# Altium project OBC-FPGA.PrjPcb
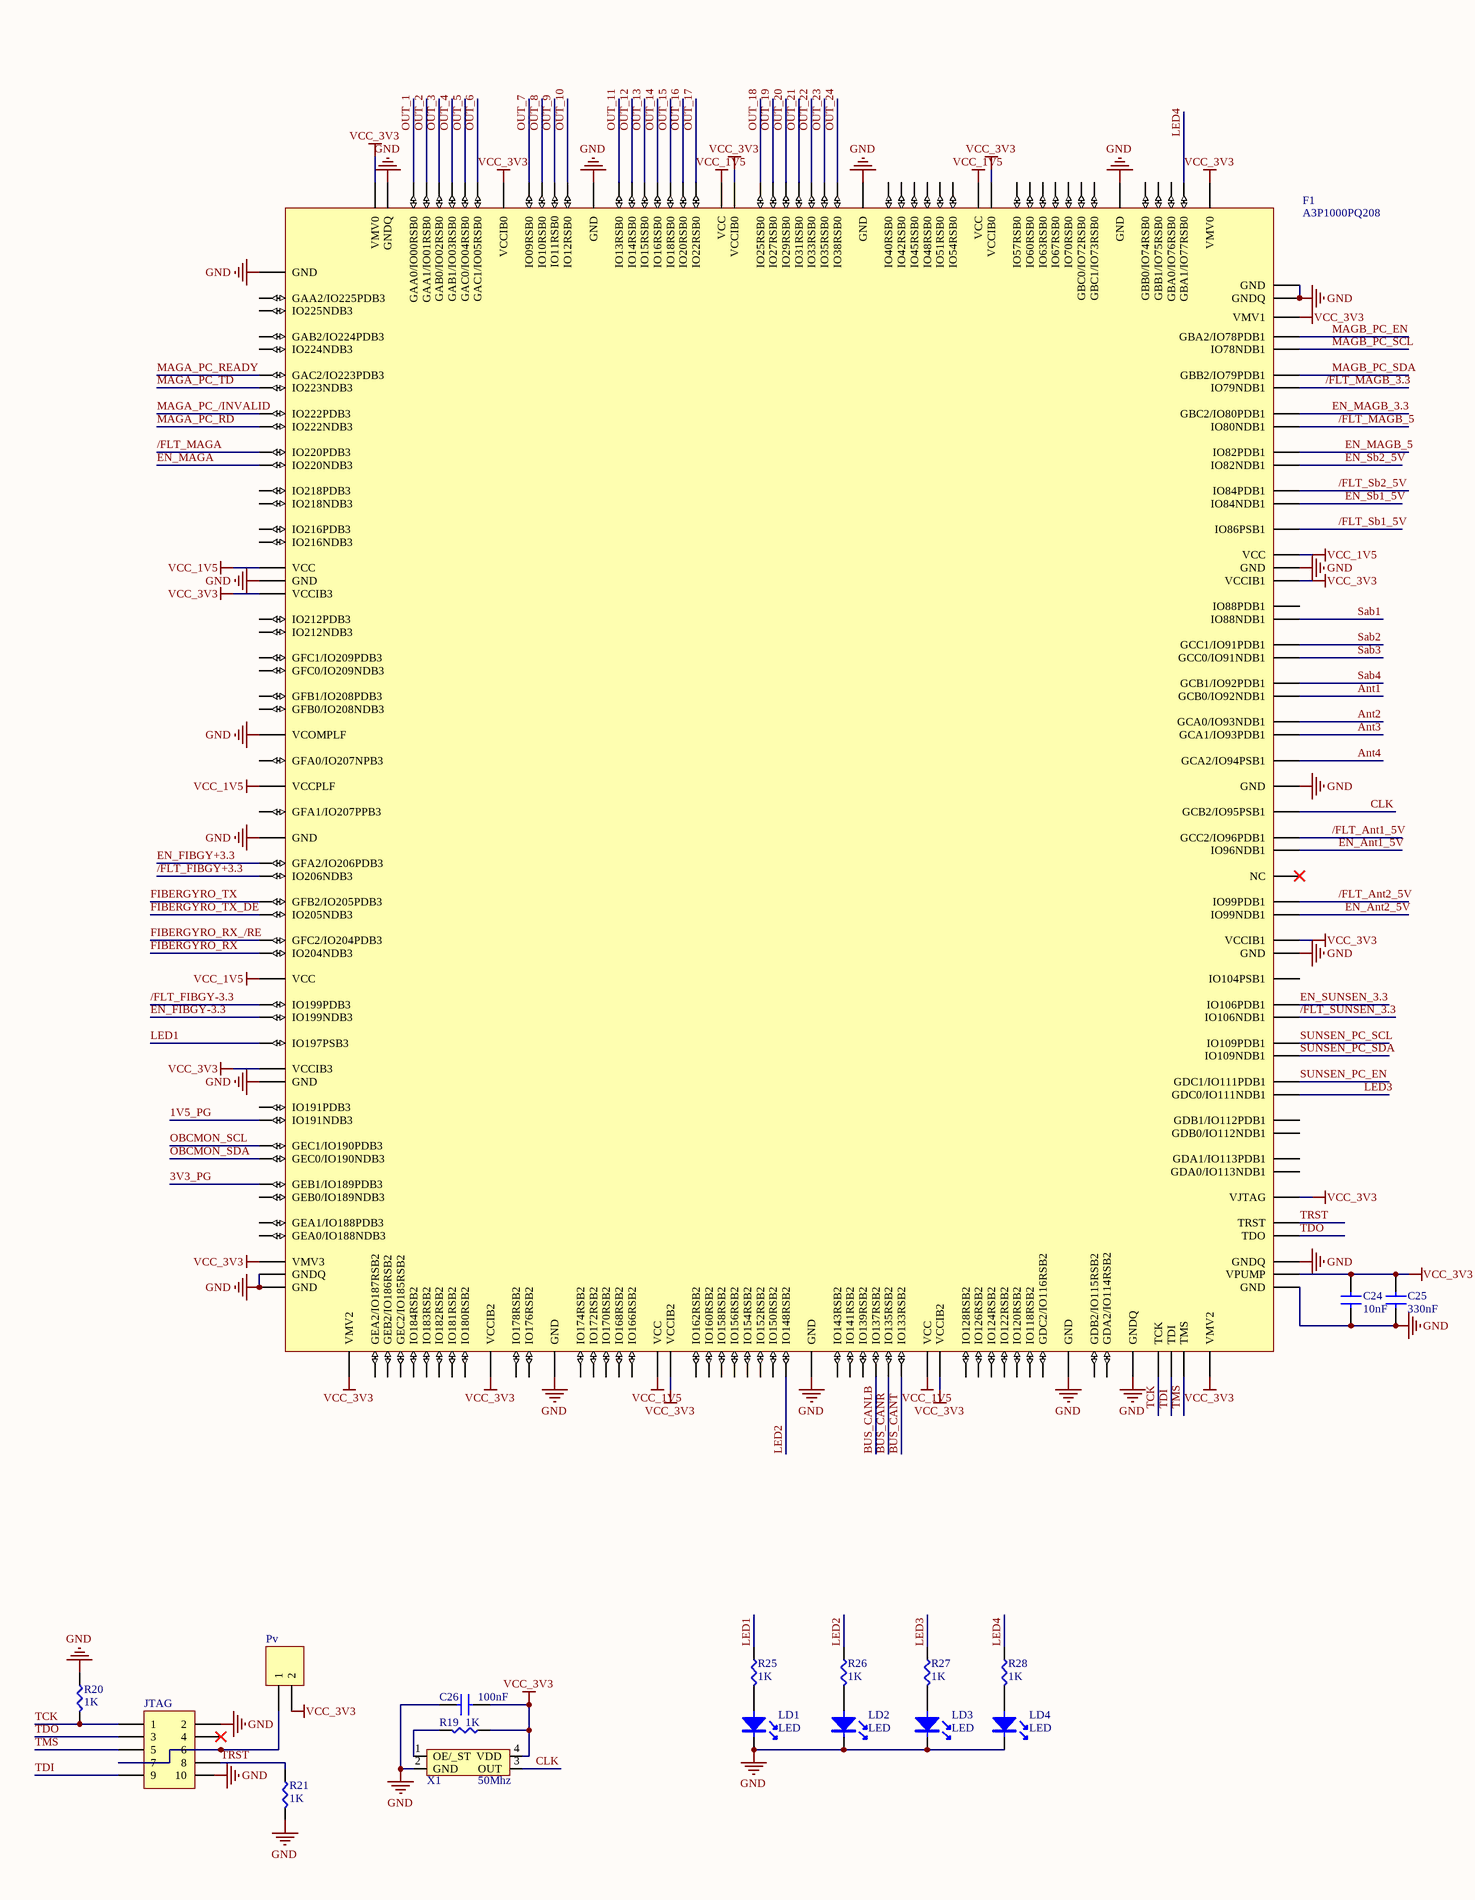
[diagram p0: OBC_My_FPGA.SchDoc, left]
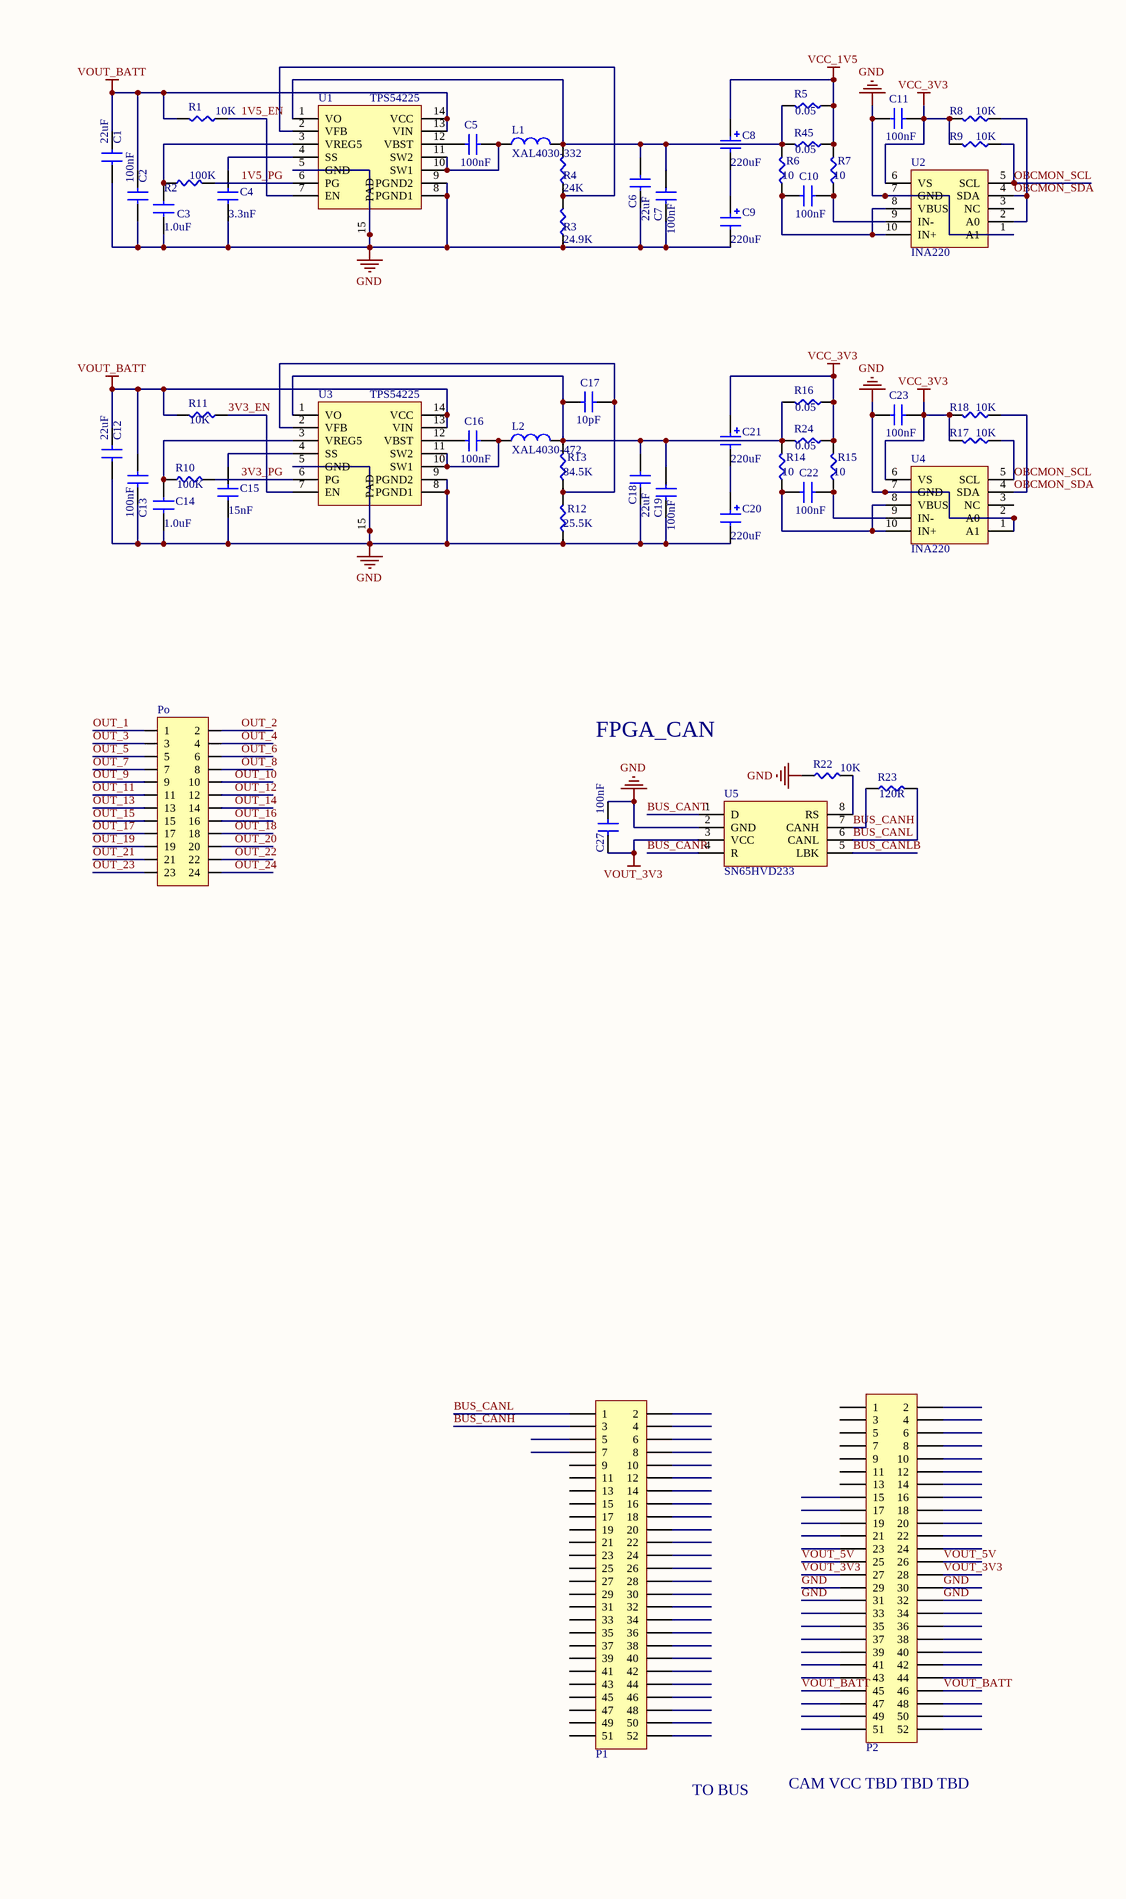
[diagram p1: OBC_My_FPGA.SchDoc, right]
2 sheets, 217 parts. Net scope: global (net labels, ports and power ports of the same name join across sheets).
Board file: OBC-FPGA.PcbDoc
Sheets:
  OBC_My_FPGA.SchDoc
  OBC_My_INTERFACE.SchDoc

## Sheet OBC_My_FPGA.SchDoc
size A2

### Parts
C1  22uF  [1210(3225)-C-IPC]
C2  100nF  [0805(2012)-C-IPC]
C3  1.0uF  [0603(1608)-C-IPC]
C4  3.3nF  [0603(1608)-C-IPC]
C5  100nF  [0603(1608)-C-IPC]
C6  22uF  [1210(3225)-C-IPC]
C7  100nF  [0805(2012)-C-IPC]
C8  220uF  [TanCap-D(7343)-C-IPC]
C9  220uF  [TanCap-D(7343)-C-IPC]
C10  100nF  [0603(1608)-C-IPC]
C11  100nF  [0603(1608)-C-IPC]
C12  22uF  [1210(3225)-C-IPC]
C13  100nF  [0805(2012)-C-IPC]
C14  1.0uF  [0603(1608)-C-IPC]
C15  15nF  [0603(1608)-C-IPC]
C16  100nF  [0603(1608)-C-IPC]
C17  10pF  [0603(1608)-C-IPC]
C18  22uF  [1210(3225)-C-IPC]
C19  100nF  [0805(2012)-C-IPC]
C20  220uF  [TanCap-D(7343)-C-IPC]
C21  220uF  [TanCap-D(7343)-C-IPC]
C22  100nF  [0603(1608)-C-IPC]
C23  100nF  [0603(1608)-C-IPC]
C24  10nF  [0603(1608)-C-IPC]
C25  330nF  [0603(1608)-C-IPC]
C26  100nF  [0603(1608)-C-IPC]
C27  100nF  [0603(1608)-C-IPC]
F1  A3P1000PQ208  [SQFP50P3060X3060X410-208N]
JTAG  Header 5X2  [HDR2X5]  (value not drawn)
L1  XAL4030-332  [Inductor-CoilCraft-XAL40xx]
L2  XAL4030-472  [Inductor-CoilCraft-XAL40xx]
LD1  LED  [0603(1608)-C-IPC]
LD2  LED  [0603(1608)-C-IPC]
LD3  LED  [0603(1608)-C-IPC]
LD4  LED  [0603(1608)-C-IPC]
P1  Header 26X2H  [DIP 26x2-2.54mm]  (value not drawn)
P2  Header 26X2H  [DIP 26x2-2.54mm]  (value not drawn)
Po  Header 12x2  [DIP 12x2-2.54mm]  (value not drawn)
Pv  Header 2  [HDR1X2]  (value not drawn)
R1  10K  [0603(1608)-R-IPC]
R2  100K  [0603(1608)-R-IPC]
R3  24.9K  [0603(1608)-R-IPC]
R4  24K  [0603(1608)-R-IPC]
R5  0.05  [1206(3216)-R-IPC]
R6  10  [0603(1608)-R-IPC]
R7  10  [0603(1608)-R-IPC]
R8  10K  [0603(1608)-R-IPC]
R9  10K  [0603(1608)-R-IPC]
R10  100K  [0603(1608)-R-IPC]
R11  10K  [0603(1608)-R-IPC]
R12  25.5K  [0603(1608)-R-IPC]
R13  84.5K  [0603(1608)-R-IPC]
R14  10  [0603(1608)-R-IPC]
R15  10  [0603(1608)-R-IPC]
R16  0.05  [1206(3216)-R-IPC]
R17  10K  [0603(1608)-R-IPC]
R18  10K  [0603(1608)-R-IPC]
R19  1K  [0603(1608)-R-IPC]
R20  1K  [0603(1608)-R-IPC]
R21  1K  [0603(1608)-R-IPC]
R22  10K  [0603(1608)-R-IPC]
R23  value 120R  [0603(1608)-R-IPC]  (hidden comment: 120)
R24  0.05  [1206(3216)-R-IPC]
R25  1K  [0603(1608)-R-IPC]
R26  1K  [0603(1608)-R-IPC]
R27  1K  [0603(1608)-R-IPC]
R28  1K  [0603(1608)-R-IPC]
R45  0.05  [1206(3216)-R-IPC]
U1  TPS54225  [TSSOP-14-4.4x5-0.65-w.TP-IPC]
U2  INA220  [TSSOP-10-3x3-IPC]
U3  TPS54225  [TSSOP-14-4.4x5-0.65-w.TP-IPC]
U4  INA220  [TSSOP-10-3x3-IPC]
U5  SN65HVD233  [SOP-8-3.9x4.9-IPC]
X1  50Mhz  [LC-SMD-3225_4P]

### Nets
GND: C1.2 C2.2 C3.1 C4.1 C6.2 C7.2 C9.2 C11.2 C12.2 C13.2 C14.1 C15.1 C18.2 C19.2 C20.2 C23.2 C24.2 C25.2 C26.2 C27.2 F1.1(GND) F1.17(GND) F1.25(VCOMPLF) F1.29(GND) F1.41(GND) F1.51(GNDQ) F1.52(GND) F1.65(GND) F1.81(GND) F1.97(GND) F1.100(GNDQ) F1.105(GND) F1.107(GNDQ) F1.122(GND) F1.130(GND) F1.141(GND) F1.155(GNDQ) F1.156(GND) F1.162(GND) F1.178(GND) F1.195(GND) F1.207(GNDQ) JTAG.2 LD1.2(K) LD2.2(K) LD3.2(K) LD4.2(K) P2.29 P2.30 P2.31 P2.32 R3.1 R12.1 R20.1 R21.2 R22.1 U1.5(GND) U1.8(PGND1) U1.9(PGND2) U1.15(PAD) U2.1(A1) U2.7(GND) U3.5(GND) U3.8(PGND1) U3.9(PGND2) U3.15(PAD) U4.1(A1) U4.2(A0) U4.7(GND) U5.2(GND) X1.2(GND)
VCC_1V5: C8.1 F1.16(VCC) F1.27(VCCPLF) F1.36(VCC) F1.71(VCC) F1.88(VCC) F1.142(VCC) F1.171(VCC) F1.187(VCC) R5.1 R7.2 R45.1
VCC_3V3: C11.1 C21.1 C23.1 C24.1 C25.1 C26.1 F1.18(VCCIB3) F1.40(VCCIB3) F1.50(VMV3) F1.53(VMV2) F1.62(VCCIB2) F1.72(VCCIB2) F1.89(VCCIB2) F1.104(VMV2) F1.106(VPUMP) F1.110(VJTAG) F1.123(VCCIB1) F1.140(VCCIB1) F1.154(VMV1) F1.157(VMV0) F1.170(VCCIB0) F1.186(VCCIB0) F1.200(VCCIB0) F1.208(VMV0) Pv.2 R8.2 R9.2 R15.2 R16.1 R17.2 R18.2 R19.1 R24.1 U2.6(VS) U4.6(VS) X1.4(VDD)
VOUT_3V3: C27.1 P2.27 P2.28 U5.3(VCC)
VOUT_5V: P2.25 P2.26
VOUT_BATT: C1.1 C2.1 C12.1 C13.1 P2.45 P2.46 R1.2 R11.2 U1.13(VIN) U1.14(VCC) U3.13(VIN) U3.14(VCC)
1V5_EN: R1.1 U1.7(EN)
1V5_PG: F1.43(IO191NDB3) R2.2 U1.6(PG)
3V3_EN: R11.1 U3.7(EN)
3V3_PG: F1.46(GEB1/IO189PDB3) R10.2 U3.6(PG)
/FLT_Ant1_5V: F1.128(GCC2/IO96PDB1)
/FLT_Ant2_5V: F1.125(IO99PDB1)
/FLT_FIBGY+3.3: F1.31(IO206NDB3)
/FLT_FIBGY-3.3: F1.37(IO199PDB3)
/FLT_MAGA: F1.10(IO220PDB3)
/FLT_MAGB_3.3: F1.150(IO79NDB1)
/FLT_MAGB_5: F1.148(IO80NDB1)
/FLT_Sb1_5V: F1.143(IO86PSB1)
/FLT_Sb2_5V: F1.145(IO84PDB1)
/FLT_SUNSEN_3.3: F1.119(IO106NDB1)
Ant1: F1.134(GCB0/IO92NDB1)
Ant2: F1.133(GCA0/IO93NDB1)
Ant3: F1.132(GCA1/IO93PDB1)
Ant4: F1.131(GCA2/IO94PSB1)
BUS_CANH: P1.3 R23.1 U5.7(CANH)
BUS_CANL: P1.1 R23.2 U5.6(CANL)
BUS_CANLB: F1.85(IO137RSB2) U5.5(LBK)
BUS_CANR: F1.86(IO135RSB2) U5.4(R)
BUS_CANT: F1.87(IO133RSB2) U5.1(D)
CLK: F1.129(GCB2/IO95PSB1) X1.3(OUT)
EN_Ant1_5V: F1.127(IO96NDB1)
EN_Ant2_5V: F1.124(IO99NDB1)
EN_FIBGY+3.3: F1.30(GFA2/IO206PDB3)
EN_FIBGY-3.3: F1.38(IO199NDB3)
EN_MAGA: F1.11(IO220NDB3)
EN_MAGB_3.3: F1.149(GBC2/IO80PDB1)
EN_MAGB_5: F1.147(IO82PDB1)
EN_Sb1_5V: F1.144(IO84NDB1)
EN_Sb2_5V: F1.146(IO82NDB1)
EN_SUNSEN_3.3: F1.120(IO106PDB1)
FIBERGYRO_RX: F1.35(IO204NDB3)
FIBERGYRO_RX_/RE: F1.34(GFC2/IO204PDB3)
FIBERGYRO_TX: F1.32(GFB2/IO205PDB3)
FIBERGYRO_TX_DE: F1.33(IO205NDB3)
LED1: F1.39(IO197PSB3) R25.1
LED2: F1.80(IO148RSB2) R26.1
LED3: F1.115(GDC0/IO111NDB1) R27.1
LED4: F1.158(GBA1/IO77RSB0) R28.1
MAGA_PC_/INVALID: F1.8(IO222PDB3)
MAGA_PC_RD: F1.9(IO222NDB3)
MAGA_PC_READY: F1.6(GAC2/IO223PDB3)
MAGA_PC_TD: F1.7(IO223NDB3)
MAGB_PC_EN: F1.153(GBA2/IO78PDB1)
MAGB_PC_SCL: F1.152(IO78NDB1)
MAGB_PC_SDA: F1.151(GBB2/IO79PDB1)
OBCMON_SCL: F1.44(GEC1/IO190PDB3) R9.1 R17.1 U2.5(SCL) U4.5(SCL)
OBCMON_SDA: F1.45(GEC0/IO190NDB3) R8.1 R18.1 U2.2(A0) U2.4(SDA) U4.4(SDA)
OUT_1: F1.206(GAA0/IO00RSB0) Po.1
OUT_2: F1.205(GAA1/IO01RSB0) Po.2
OUT_3: F1.204(GAB0/IO02RSB0) Po.3
OUT_4: F1.203(GAB1/IO03RSB0) Po.4
OUT_5: F1.202(GAC0/IO04RSB0) Po.5
OUT_6: F1.201(GAC1/IO05RSB0) Po.6
OUT_7: F1.199(IO09RSB0) Po.7
OUT_8: F1.198(IO10RSB0) Po.8
OUT_9: F1.197(IO11RSB0) Po.9
OUT_10: F1.196(IO12RSB0) Po.10
OUT_11: F1.194(IO13RSB0) Po.11
OUT_12: F1.193(IO14RSB0) Po.12
OUT_13: F1.192(IO15RSB0) Po.13
OUT_14: F1.191(IO16RSB0) Po.14
OUT_15: F1.190(IO18RSB0) Po.15
OUT_16: F1.189(IO20RSB0) Po.16
OUT_17: F1.188(IO22RSB0) Po.17
OUT_18: F1.185(IO25RSB0) Po.18
OUT_19: F1.184(IO27RSB0) Po.19
OUT_20: F1.183(IO29RSB0) Po.20
OUT_21: F1.182(IO31RSB0) Po.21
OUT_22: F1.181(IO33RSB0) Po.22
OUT_23: F1.180(IO35RSB0) Po.23
OUT_24: F1.179(IO38RSB0) Po.24
Sab1: F1.138(IO88NDB1)
Sab2: F1.137(GCC1/IO91PDB1)
Sab3: F1.136(GCC0/IO91NDB1)
Sab4: F1.135(GCB1/IO92PDB1)
SUNSEN_PC_EN: F1.116(GDC1/IO111PDB1)
SUNSEN_PC_SCL: F1.118(IO109PDB1)
SUNSEN_PC_SDA: F1.117(IO109NDB1)
TCK: F1.101(TCK) JTAG.1 R20.2
TDI: F1.102(TDI) JTAG.9
TDO: F1.108(TDO) JTAG.3
TMS: F1.103(TMS) JTAG.5
TRST: F1.109(TRST) JTAG.8 R21.1
NetC3_2: C3.2 R2.1 U1.3(VREG5)
NetC4_2: C4.2 U1.4(SS)
NetC5_1: C5.1 L1.1 U1.10(SW1) U1.11(SW2)
NetC5_2: C5.2 U1.12(VBST)
NetC6_1: C6.1 C7.1 L1.2 R4.2 R5.2 R6.2 R45.2 U1.1(VO)
NetC8_2: C8.2 C9.1
NetC10_1: C10.1 R7.1 U2.9(IN-)
NetC10_2: C10.2 R6.1 U2.8(VBUS) U2.10(IN+)
NetC14_2: C14.2 R10.1 U3.3(VREG5)
NetC15_2: C15.2 U3.4(SS)
NetC16_1: C16.1 L2.1 U3.10(SW1) U3.11(SW2)
NetC16_2: C16.2 U3.12(VBST)
NetC17_1: C17.1 R12.2 R13.1 U3.2(VFB)
NetC17_2: C17.2 C18.1 C19.1 L2.2 R13.2 R14.2 R16.2 R24.2 U3.1(VO)
NetC20_1: C20.1 C21.2
NetC22_1: C22.1 R15.1 U4.9(IN-)
NetC22_2: C22.2 R14.1 U4.8(VBUS) U4.10(IN+)
NetJTAG_6: JTAG.6 JTAG.7 Pv.1
NetLD1_1: LD1.1(A) R25.2
NetLD2_1: LD2.1(A) R26.2
NetLD3_1: LD3.1(A) R27.2
NetLD4_1: LD4.1(A) R28.2
NetR3_2: R3.2 R4.1 U1.2(VFB)
NetR19_2: R19.2 X1.1(OE/_ST)
NetR22_2: R22.2 U5.8(RS)

Not connected (* = marked no-connect by the designer): F1 2(GAA2/IO225PDB3) 3(IO225NDB3) 4(GAB2/IO224PDB3) 5(IO224NDB3) 12(IO218PDB3) 13(IO218NDB3) 14(IO216PDB3) 15(IO216NDB3) 19(IO212PDB3) 20(IO212NDB3) 21(GFC1/IO209PDB3) 22(GFC0/IO209NDB3) 23(GFB1/IO208PDB3) 24(GFB0/IO208NDB3) 26(GFA0/IO207NPB3) 28(GFA1/IO207PPB3) 42(IO191PDB3) 47(GEB0/IO189NDB3) 48(GEA1/IO188PDB3) 49(GEA0/IO188NDB3) 54(GEA2/IO187RSB2) 55(GEB2/IO186RSB2) 56(GEC2/IO185RSB2) 57(IO184RSB2) 58(IO183RSB2) 59(IO182RSB2) 60(IO181RSB2) 61(IO180RSB2) 63(IO178RSB2) 64(IO176RSB2) 66(IO174RSB2) 67(IO172RSB2) 68(IO170RSB2) 69(IO168RSB2) 70(IO166RSB2) 73(IO162RSB2) 74(IO160RSB2) 75(IO158RSB2) 76(IO156RSB2) 77(IO154RSB2) 78(IO152RSB2) 79(IO150RSB2) 82(IO143RSB2) 83(IO141RSB2) 84(IO139RSB2) 90(IO128RSB2) 91(IO126RSB2) 92(IO124RSB2) 93(IO122RSB2) 94(IO120RSB2) 95(IO118RSB2) 96(GDC2/IO116RSB2) 98(GDB2/IO115RSB2) 99(GDA2/IO114RSB2) 111(GDA0/IO113NDB1) 112(GDA1/IO113PDB1) 113(GDB0/IO112NDB1) 114(GDB1/IO112PDB1) 121(IO104PSB1) 126(NC)* 139(IO88PDB1) 159(GBA0/IO76RSB0) 160(GBB1/IO75RSB0) 161(GBB0/IO74RSB0) 163(GBC1/IO73RSB0) 164(GBC0/IO72RSB0) 165(IO70RSB0) 166(IO67RSB0) 167(IO63RSB0) 168(IO60RSB0) 169(IO57RSB0) 172(IO54RSB0) 173(IO51RSB0) 174(IO48RSB0) 175(IO45RSB0) 176(IO42RSB0) 177(IO40RSB0); JTAG 4* 10; P1 2 4 5 6 7 8 9 10 11 12 13 14 15 16 17 18 19 20 21 22 23 24 25 26 27 28 29 30 31 32 33 34 35 36 37 38 39 40 41 42 43 44 45 46 47 48 49 50 51 52; P2 1 2 3 4 5 6 7 8 9 10 11 12 13 14 15 16 17 18 19 20 21 22 23 24 33 34 35 36 37 38 39 40 41 42 43 44 47 48 49 50 51 52; U2 3(NC); U4 3(NC)

### Notes on the sheet
- FPGA_CAN
- TO BUS
- (near P2) CAM VCC TBD TBD TBD
- Labels drawn without touching a wire or pin: GND

### Library data of the parts
C1-C7 C10-C19 C22-C27 = Cap_1: Nonpolarized Capacitor (Surface Mount)
  C1 C6 C12 C18: Value: 22uF
  C2 C5 C7 C10 C11 C13 C16 C19 C22 C23 C26 C27: Value: 100nF
  C3 C14: Value: 1.0uF
  C4: Value: 3.3nF
  C15: Value: 15nF
  C17: Value: 10pF
  C24: Value: 10nF
  C25: Value: 330nF
C8 C9 C20 C21 = Cap Pol_1: Polarized Capacitor (Surface Mount); Value: 220uF
F1 = A3P100PQ208: ProASIC3 Flash Family FPGAs
JTAG = Header 5X2: Header, 5-Pin, Dual row; LatestRevisionDate: 17-Jul-2002; LatestRevisionNote: Re-released for DXP Platform.; Publisher: Altium Limited
L1 L2 = Inductor_1: Inductor
P1 P2 = Header 26X2H: Header, 26-Pin, Dual row, Right Angle
Pv = Header 2: Header, 2-Pin; LatestRevisionDate: 17-Jul-2002; LatestRevisionNote: Re-released for DXP Platform.; Publisher: Altium Limited
R1-R28 R45 = Res_1: Resistor
  R1 R8 R9 R11 R17 R18 R22: Value: 10K
  R2 R10: Value: 100K
  R3: Value: 24.9K
  R4: Value: 24K
  R5 R16 R24 R45: Value: 0.05
  R6 R7 R14 R15: Value: 10
  R12: Value: 25.5K
  R13: Value: 84.5K
  R19-R21 R25-R28: Value: 1K
U1 U3 = TPS54225: 4.5V to 18V Input, 2-A Synchronous Step-Down SWIFT Converter
U2 U4 = INA220: High- or Low-Side, Bidirectional Current and Power Monitor With Two-Wire Interface
U5 = SN65HVD233: 3.3-V CAN Bus Transceivers
X1 = SiT1602: Standard Frequency Oscillator SiT1602

## Sheet OBC_My_INTERFACE.SchDoc
size A2
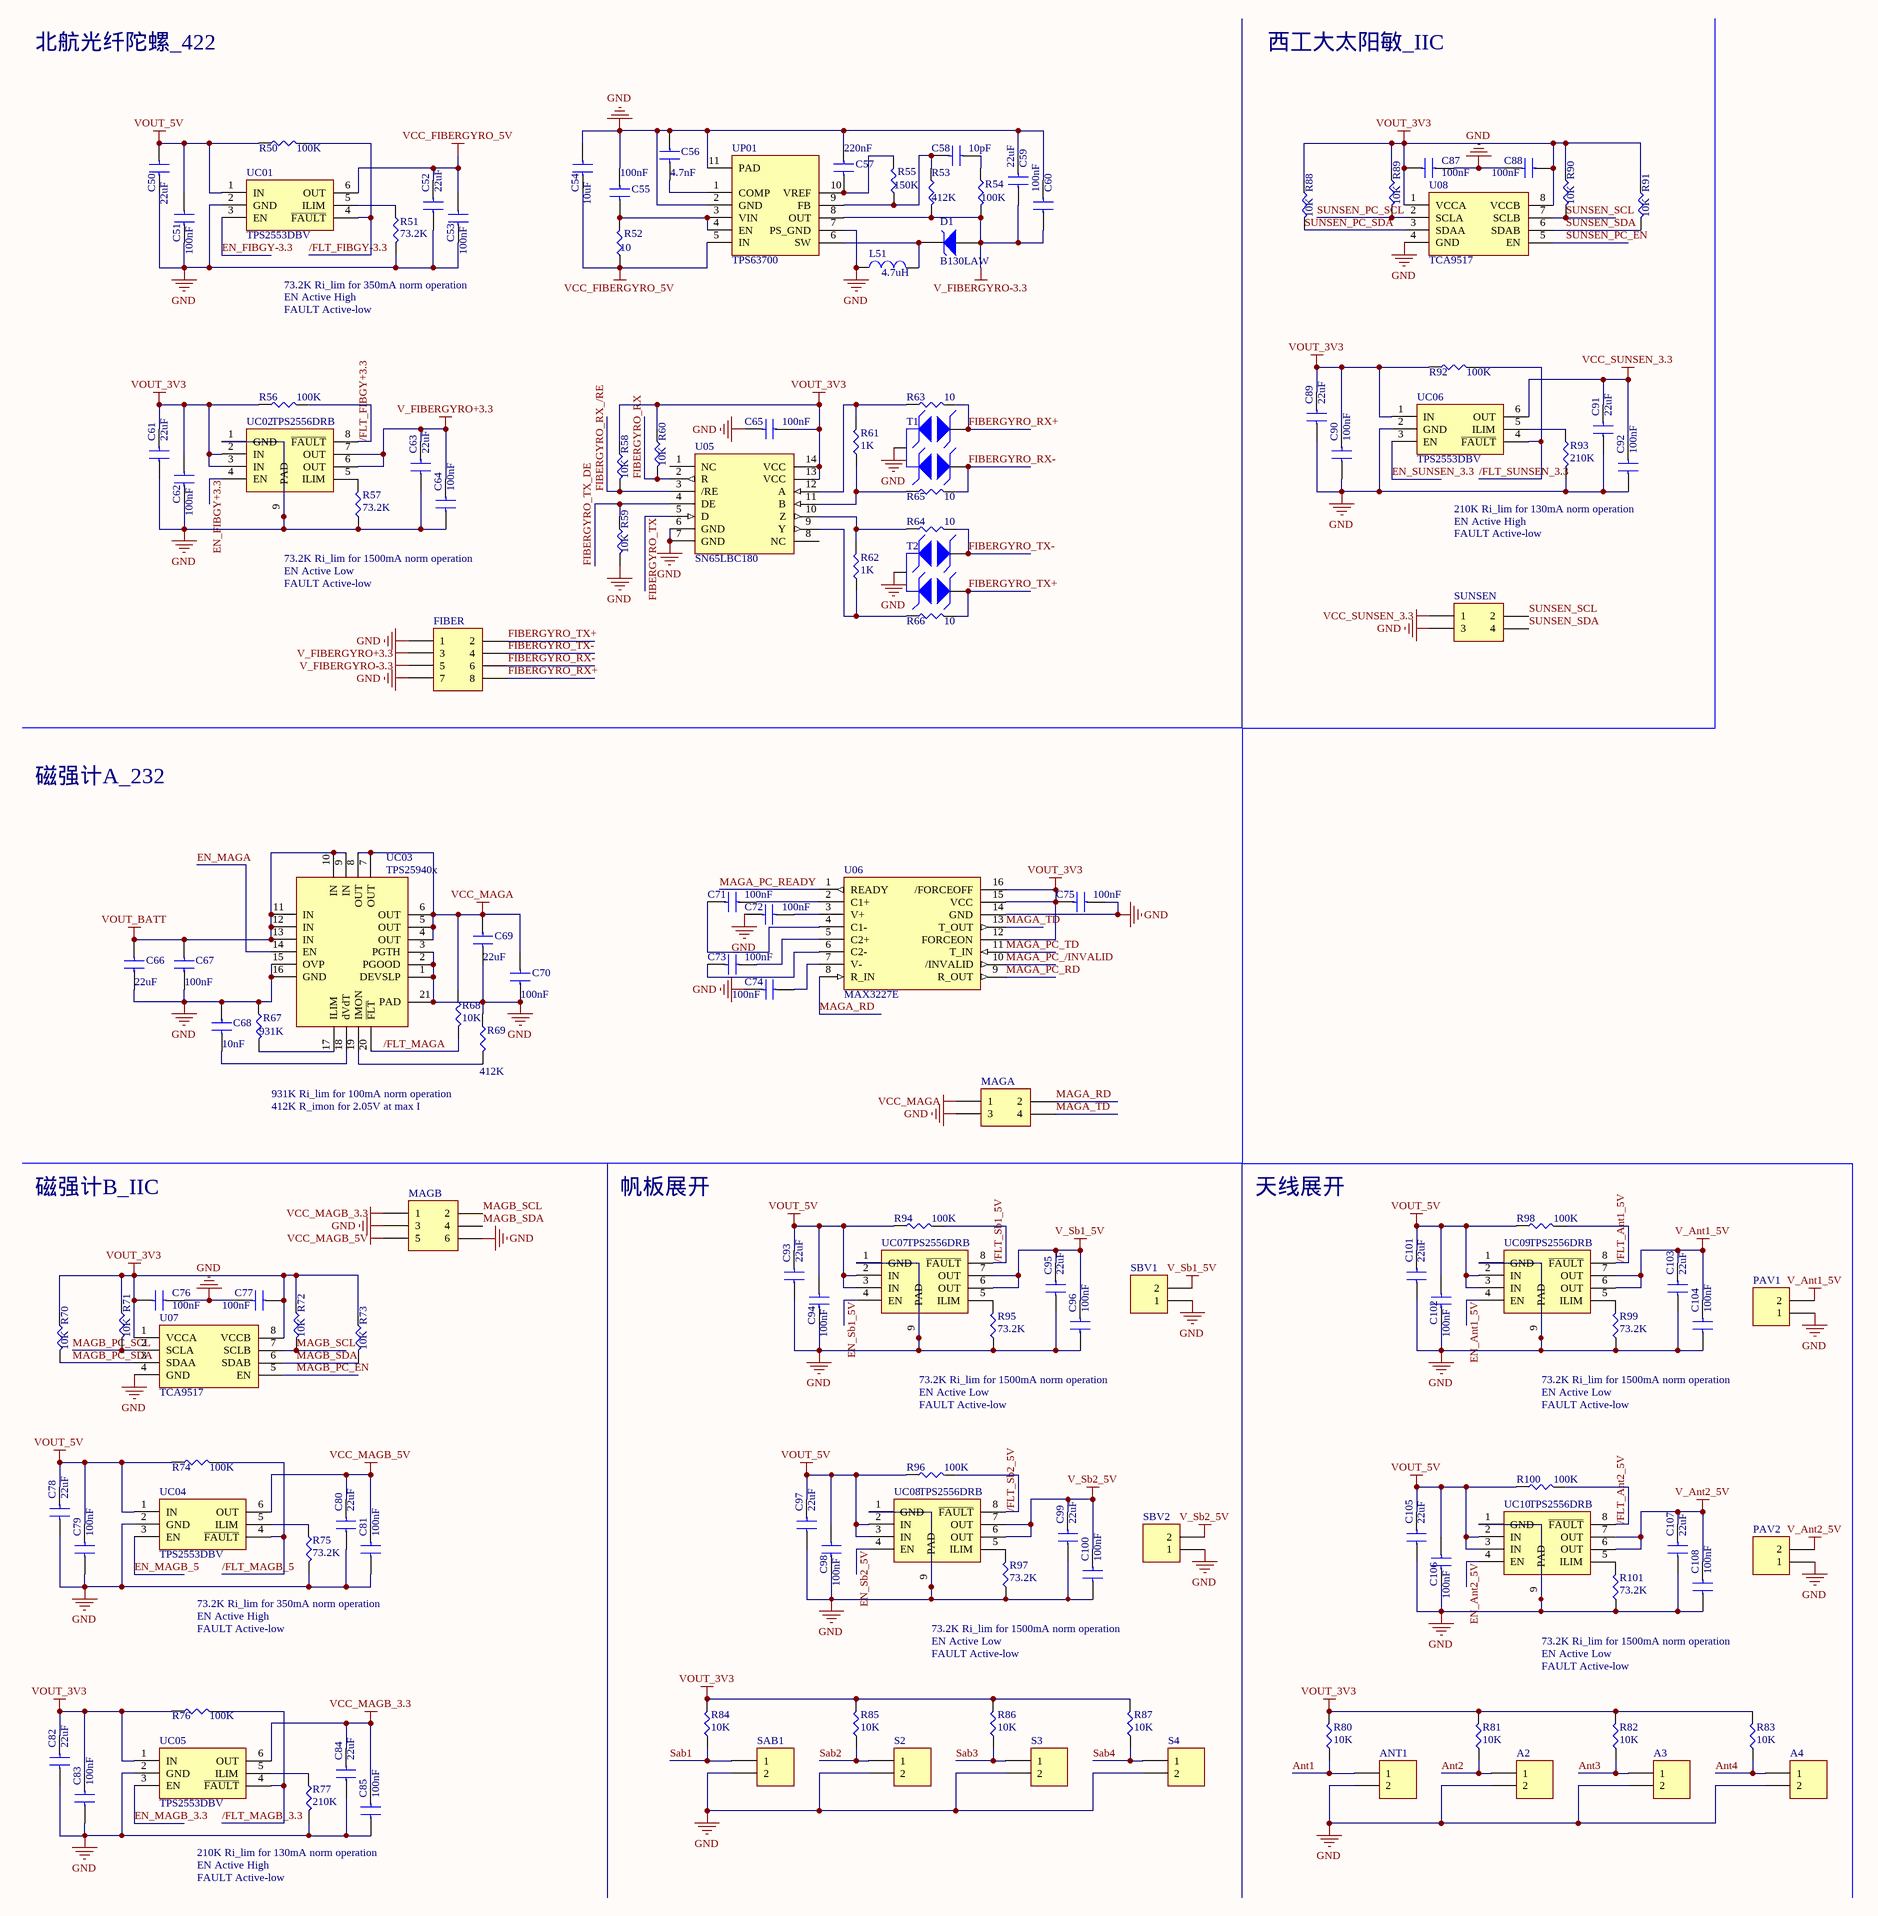
[diagram p2: OBC_My_INTERFACE.SchDoc]

### Parts
A2  Header 2  [HDR1X2]  (value not drawn)
A3  Header 2  [HDR1X2]  (value not drawn)
A4  Header 2  [HDR1X2]  (value not drawn)
ANT1  Header 2  [HDR1X2]  (value not drawn)
C50  22uF  [1210(3225)-C-IPC]
C51  100nF  [0805(2012)-C-IPC]
C52  22uF  [1210(3225)-C-IPC]
C53  100nF  [0805(2012)-C-IPC]
C54  10uF  [0805(2012)-C-IPC]
C55  100nF  [0603(1608)-C-IPC]
C56  4.7nF  [0603(1608)-C-IPC]
C57  220nF  [0603(1608)-C-IPC]
C58  10pF  [0603(1608)-C-IPC]
C59  22uF  [1210(3225)-C-IPC]
C60  100nF  [0805(2012)-C-IPC]
C61  22uF  [1210(3225)-C-IPC]
C62  100nF  [0805(2012)-C-IPC]
C63  22uF  [1210(3225)-C-IPC]
C64  100nF  [0805(2012)-C-IPC]
C65  100nF  [0603(1608)-C-IPC]
C66  22uF  [1210(3225)-C-IPC]
C67  100nF  [0805(2012)-C-IPC]
C68  10nF  [0603(1608)-C-IPC]
C69  22uF  [1210(3225)-C-IPC]
C70  100nF  [0805(2012)-C-IPC]
C71  100nF  [0603(1608)-C-IPC]
C72  100nF  [0603(1608)-C-IPC]
C73  100nF  [0603(1608)-C-IPC]
C74  100nF  [0603(1608)-C-IPC]
C75  100nF  [0603(1608)-C-IPC]
C76  100nF  [0603(1608)-C-IPC]
C77  100nF  [0603(1608)-C-IPC]
C78  22uF  [1210(3225)-C-IPC]
C79  100nF  [0805(2012)-C-IPC]
C80  22uF  [1210(3225)-C-IPC]
C81  100nF  [0805(2012)-C-IPC]
C82  22uF  [1210(3225)-C-IPC]
C83  100nF  [0805(2012)-C-IPC]
C84  22uF  [1210(3225)-C-IPC]
C85  100nF  [0805(2012)-C-IPC]
C87  100nF  [0603(1608)-C-IPC]
C88  100nF  [0603(1608)-C-IPC]
C89  22uF  [1210(3225)-C-IPC]
C90  100nF  [0805(2012)-C-IPC]
C91  22uF  [1210(3225)-C-IPC]
C92  100nF  [0805(2012)-C-IPC]
C93  22uF  [1210(3225)-C-IPC]
C94  100nF  [0805(2012)-C-IPC]
C95  22uF  [1210(3225)-C-IPC]
C96  100nF  [0805(2012)-C-IPC]
C97  22uF  [1210(3225)-C-IPC]
C98  100nF  [0805(2012)-C-IPC]
C99  22uF  [1210(3225)-C-IPC]
C100  100nF  [0805(2012)-C-IPC]
C101  22uF  [1210(3225)-C-IPC]
C102  100nF  [0805(2012)-C-IPC]
C103  22uF  [1210(3225)-C-IPC]
C104  100nF  [0805(2012)-C-IPC]
C105  22uF  [1210(3225)-C-IPC]
C106  100nF  [0805(2012)-C-IPC]
C107  22uF  [1210(3225)-C-IPC]
C108  100nF  [0805(2012)-C-IPC]
D1  B130LAW  [SOD-123-D-IPC]
FIBER  Header 4X2  [HDR2X4]  (value not drawn)
L51  value 4.7uH  [Inductor-CoilCraft-XAL40xx]  (hidden comment: XAL4030-472)
MAGA  Header 2X2  [HDR2X2]  (value not drawn)
MAGB  Header 3X2  [HDR2X3]  (value not drawn)
PAV1  Header 2  [HDR1X2]  (value not drawn)
PAV2  Header 2  [HDR1X2]  (value not drawn)
R50  100K  [0603(1608)-R-IPC]
R51  73.2K  [0603(1608)-R-IPC]
R52  10  [0603(1608)-R-IPC]
R53  412K  [0603(1608)-R-IPC]
R54  100K  [0603(1608)-R-IPC]
R55  150K  [0603(1608)-R-IPC]
R56  100K  [0603(1608)-R-IPC]
R57  73.2K  [0603(1608)-R-IPC]
R58  10K  [0603(1608)-R-IPC]
R59  10K  [0603(1608)-R-IPC]
R60  10K  [0603(1608)-R-IPC]
R61  value 1K  [0603(1608)-R-IPC]  (hidden comment: Rt)
R62  value 1K  [0603(1608)-R-IPC]  (hidden comment: Rt)
R63  10  [0603(1608)-R-IPC]
R64  10  [0603(1608)-R-IPC]
R65  10  [0603(1608)-R-IPC]
R66  10  [0603(1608)-R-IPC]
R67  931K  [0603(1608)-R-IPC]
R68  10K  [0603(1608)-R-IPC]
R69  412K  [0603(1608)-R-IPC]
R70  10K  [0603(1608)-R-IPC]
R71  10K  [0603(1608)-R-IPC]
R72  10K  [0603(1608)-R-IPC]
R73  10K  [0603(1608)-R-IPC]
R74  100K  [0603(1608)-R-IPC]
R75  73.2K  [0603(1608)-R-IPC]
R76  100K  [0603(1608)-R-IPC]
R77  210K  [0603(1608)-R-IPC]
R80  10K  [0603(1608)-R-IPC]
R81  10K  [0603(1608)-R-IPC]
R82  10K  [0603(1608)-R-IPC]
R83  10K  [0603(1608)-R-IPC]
R84  10K  [0603(1608)-R-IPC]
R85  10K  [0603(1608)-R-IPC]
R86  10K  [0603(1608)-R-IPC]
R87  10K  [0603(1608)-R-IPC]
R88  10K  [0603(1608)-R-IPC]
R89  10K  [0603(1608)-R-IPC]
R90  10K  [0603(1608)-R-IPC]
R91  10K  [0603(1608)-R-IPC]
R92  100K  [0603(1608)-R-IPC]
R93  210K  [0603(1608)-R-IPC]
R94  100K  [0603(1608)-R-IPC]
R95  73.2K  [0603(1608)-R-IPC]
R96  100K  [0603(1608)-R-IPC]
R97  73.2K  [0603(1608)-R-IPC]
R98  100K  [0603(1608)-R-IPC]
R99  73.2K  [0603(1608)-R-IPC]
R100  100K  [0603(1608)-R-IPC]
R101  73.2K  [0603(1608)-R-IPC]
S2  Header 2  [HDR1X2]  (value not drawn)
S3  Header 2  [HDR1X2]  (value not drawn)
S4  Header 2  [HDR1X2]  (value not drawn)
SAB1  Header 2  [HDR1X2]  (value not drawn)
SBV1  Header 2  [HDR1X2]  (value not drawn)
SBV2  Header 2  [HDR1X2]  (value not drawn)
SUNSEN  Header 2X2  [HDR2X2]  (value not drawn)
T1  TVS-0502B  [SOT23-3]  (value not drawn)
T2  TVS-0502B  [SOT23-3]  (value not drawn)
U05  SN65LBC180  [SOIC127P600X175-14N]
U06  MAX3227E  [SSOP-16_208mil]
U07  TCA9517  [TSSOP-8-3x3-IPC]
U08  TCA9517  [TSSOP-8-3x3-IPC]
UC01  TPS2553DBV  [SOT23-6-IPC]
UC02  TPS2556DRB  [SON-8-3x3-w.TP-IPC]
UC03  TPS25940x  [QFN-20-0.5-3x4-w.TP-IPC]
UC04  TPS2553DBV  [SOT23-6-IPC]
UC05  TPS2553DBV  [SOT23-6-IPC]
UC06  TPS2553DBV  [SOT23-6-IPC]
UC07  TPS2556DRB  [SON-8-3x3-w.TP-IPC]
UC08  TPS2556DRB  [SON-8-3x3-w.TP-IPC]
UC09  TPS2556DRB  [SON-8-3x3-w.TP-IPC]
UC10  TPS2556DRB  [SON-8-3x3-w.TP-IPC]
UP01  TPS63700  [DFN-10-0.5-3x3-w.TP-IPC]

### Nets
GND: A2.2 A3.2 A4.2 ANT1.2 C50.2 C51.2 C52.2 C53.2 C54.1 C55.2 C56.2 C57.2 C59.1 C60.1 C61.2 C62.2 C63.2 C64.2 C65.2 C66.2 C67.2 C68.2 C69.2 C70.2 C72.1 C74.2 C75.1 C76.2 C77.2 C78.2 C79.2 C80.2 C81.2 C82.2 C83.2 C84.2 C85.2 C87.2 C88.2 C89.2 C90.2 C91.2 C92.2 C93.2 C94.2 C95.2 C96.2 C97.2 C98.2 C99.2 C100.2 C101.2 C102.2 C103.2 C104.2 C105.2 C106.2 C107.2 C108.2 FIBER.1 FIBER.7 L51.1 MAGA.3 MAGB.3 MAGB.6 PAV1.1 PAV2.1 R51.2 R57.1 R59.2 R67.1 R69.1 R75.2 R77.2 R93.2 R95.1 R97.1 R99.1 R101.1 S2.2 S3.2 S4.2 SAB1.2 SBV1.1 SBV2.1 SUNSEN.3 T1.3 T2.3 U05.6(GND) U05.7(GND) U06.14(GND) U07.4(GND) U08.4(GND) UC01.2(GND) UC02.1(GND) UC02.9(PAD) UC03.1(DEVSLP) UC03.2(PGOOD) UC03.3(PGTH) UC03.15(OVP) UC03.16(GND) UC03.21(PAD) UC04.2(GND) UC05.2(GND) UC06.2(GND) UC07.1(GND) UC07.9(PAD) UC08.1(GND) UC08.9(PAD) UC09.1(GND) UC09.9(PAD) UC10.1(GND) UC10.9(PAD) UP01.2(GND) UP01.7(PS_GND) UP01.11(PAD)
V_Ant1_5V: C103.1 C104.1 PAV1.2 UC09.6(OUT) UC09.7(OUT)
V_Ant2_5V: C107.1 C108.1 PAV2.2 UC10.6(OUT) UC10.7(OUT)
V_FIBERGYRO+3.3: C63.1 C64.1 FIBER.3 UC02.6(OUT) UC02.7(OUT)
V_FIBERGYRO-3.3: C59.2 C60.2 D1.1(A) FIBER.5 R53.2 R54.2 UP01.8(OUT)
V_Sb1_5V: C95.1 C96.1 SBV1.2 UC07.6(OUT) UC07.7(OUT)
V_Sb2_5V: C99.1 C100.1 SBV2.2 UC08.6(OUT) UC08.7(OUT)
VCC_FIBERGYRO_5V: C52.1 C53.1 C54.2 R52.1 UC01.6(OUT) UP01.5(IN)
VCC_MAGA: C69.1 C70.1 MAGA.1 R68.1 UC03.4(OUT) UC03.5(OUT) UC03.6(OUT) UC03.7(OUT) UC03.8(OUT)
VCC_MAGB_3.3: C84.1 C85.1 MAGB.1 UC05.6(OUT)
VCC_MAGB_5V: C80.1 C81.1 MAGB.5 UC04.6(OUT)
VCC_SUNSEN_3.3: C91.1 C92.1 SUNSEN.1 UC06.6(OUT)
VOUT_3V3: C61.1 C62.1 C65.1 C75.2 C76.1 C77.1 C82.1 C83.1 C87.1 C88.1 C89.1 C90.1 R56.1 R58.1 R60.1 R70.1 R71.1 R72.1 R73.1 R76.1 R80.2 R81.2 R82.2 R83.2 R84.2 R85.2 R86.2 R87.2 R88.1 R89.1 R90.1 R91.1 R92.1 U05.13(VCC) U05.14(VCC) U06.12(FORCEON) U06.15(VCC) U06.16(/FORCEOFF) U07.1(VCCA) U07.8(VCCB) U08.1(VCCA) U08.8(VCCB) UC02.2(IN) UC02.3(IN) UC05.1(IN) UC06.1(IN)
VOUT_5V: C50.1 C51.1 C78.1 C79.1 C93.1 C94.1 C97.1 C98.1 C101.1 C102.1 C105.1 C106.1 R50.1 R74.1 R94.1 R96.1 R98.1 R100.1 UC01.1(IN) UC04.1(IN) UC07.2(IN) UC07.3(IN) UC08.2(IN) UC08.3(IN) UC09.2(IN) UC09.3(IN) UC10.2(IN) UC10.3(IN)
VOUT_BATT: C66.1 C67.1 UC03.9(IN) UC03.10(IN) UC03.11(IN) UC03.12(IN) UC03.13(IN)
/FLT_Ant1_5V: R98.2 UC09.8(~{FAULT})
/FLT_Ant2_5V: R100.2 UC10.8(~{FAULT})
/FLT_FIBGY+3.3: R56.2 UC02.8(~{FAULT})
/FLT_FIBGY-3.3: R50.2 UC01.4(~{FAULT})
/FLT_MAGA: R68.2 UC03.20(~{FLT})
/FLT_MAGB_3.3: R76.2 UC05.4(~{FAULT})
/FLT_MAGB_5: R74.2 UC04.4(~{FAULT})
/FLT_Sb1_5V: R94.2 UC07.8(~{FAULT})
/FLT_Sb2_5V: R96.2 UC08.8(~{FAULT})
/FLT_SUNSEN_3.3: R92.2 UC06.4(~{FAULT})
Ant1: ANT1.1 R80.1
Ant2: A2.1 R81.1
Ant3: A3.1 R82.1
Ant4: A4.1 R83.1
EN_Ant1_5V: UC09.4(EN)
EN_Ant2_5V: UC10.4(EN)
EN_FIBGY+3.3: UC02.4(EN)
EN_FIBGY-3.3: UC01.3(EN)
EN_MAGA: UC03.14(EN)
EN_MAGB_3.3: UC05.3(EN)
EN_MAGB_5: UC04.3(EN)
EN_Sb1_5V: UC07.4(EN)
EN_Sb2_5V: UC08.4(EN)
EN_SUNSEN_3.3: UC06.3(EN)
FIBERGYRO_RX: R60.2 U05.2(R)
FIBERGYRO_RX+: FIBER.8 R63.2 T1.2
FIBERGYRO_RX-: FIBER.6 R65.2 T1.1
FIBERGYRO_RX_/RE: R58.2 U05.3(/RE)
FIBERGYRO_TX: U05.5(D)
FIBERGYRO_TX+: FIBER.2 R66.2 T2.1
FIBERGYRO_TX-: FIBER.4 R64.2 T2.2
FIBERGYRO_TX_DE: R59.1 U05.4(DE)
MAGA_PC_/INVALID: U06.10(/INVALID)
MAGA_PC_RD: U06.9(R_OUT)
MAGA_PC_READY: U06.1(READY)
MAGA_PC_TD: U06.11(T_IN)
MAGA_RD: MAGA.2 U06.8(R_IN)
MAGA_TD: MAGA.4 U06.13(T_OUT)
MAGB_PC_EN: U07.5(EN)
MAGB_PC_SCL: R71.2 U07.2(SCLA)
MAGB_PC_SDA: R70.2 U07.3(SDAA)
MAGB_SCL: MAGB.2 R72.2 U07.7(SCLB)
MAGB_SDA: MAGB.4 R73.2 U07.6(SDAB)
Sab1: R84.1 SAB1.1
Sab2: R85.1 S2.1
Sab3: R86.1 S3.1
Sab4: R87.1 S4.1
SUNSEN_PC_EN: U08.5(EN)
SUNSEN_PC_SCL: R89.2 U08.2(SCLA)
SUNSEN_PC_SDA: R88.2 U08.3(SDAA)
SUNSEN_SCL: R90.2 SUNSEN.2 U08.7(SCLB)
SUNSEN_SDA: R91.2 SUNSEN.4 U08.6(SDAB)
NetC55_1: C55.1 R52.2 UP01.3(VIN) UP01.4(EN)
NetC56_1: C56.1 UP01.1(COMP)
NetC57_1: C57.1 R55.2 UP01.10(VREF)
NetC58_1: C58.1 R54.1
NetC58_2: C58.2 R53.1 R55.1 UP01.9(FB)
NetC68_1: C68.1 UC03.18(dVdT)
NetC71_1: C71.1 U06.2(C1+)
NetC71_2: C71.2 U06.4(C1-)
NetC72_2: C72.2 U06.3(V+)
NetC73_1: C73.1 U06.5(C2+)
NetC73_2: C73.2 U06.6(C2-)
NetC74_1: C74.1 U06.7(V-)
NetD1_2: D1.2(K) L51.2 UP01.6(SW)
NetR51_1: R51.1 UC01.5(ILIM)
NetR57_2: R57.2 UC02.5(ILIM)
NetR61_1: R61.1 R65.1 U05.11(B)
NetR61_2: R61.2 R63.1 U05.12(A)
NetR62_1: R62.1 R66.1 U05.9(Y)
NetR62_2: R62.2 R64.1 U05.10(Z)
NetR67_2: R67.2 UC03.17(ILIM)
NetR69_2: R69.2 UC03.19(IMON)
NetR75_1: R75.1 UC04.5(ILIM)
NetR77_1: R77.1 UC05.5(ILIM)
NetR93_1: R93.1 UC06.5(ILIM)
NetR95_2: R95.2 UC07.5(ILIM)
NetR97_2: R97.2 UC08.5(ILIM)
NetR99_2: R99.2 UC09.5(ILIM)
NetR101_2: R101.2 UC10.5(ILIM)

Not connected (* = marked no-connect by the designer): U05 1(NC) 8(NC)

### Notes on the sheet
- 北航光纤陀螺_422
- 西工大太阳敏_IIC
- 73.2K Ri_lim for 350mA norm operation
- EN Active High
- FAULT Active-low
- 210K Ri_lim for 130mA norm operation
- 73.2K Ri_lim for 1500mA norm operation
- EN Active Low
- 磁强计A_232
- 931K Ri_lim for 100mA norm operation
- 412K R_imon for 2.05V at max I
- 磁强计B_IIC
- 帆板展开
- 天线展开

### Library data of the parts
A2-A4 ANT1 PAV1 PAV2 S2-S4 SAB1 SBV1 SBV2 = Header 2: Header, 2-Pin; LatestRevisionDate: 17-Jul-2002; LatestRevisionNote: Re-released for DXP Platform.; Publisher: Altium Limited
C50-C85 C87-C108 = Cap_1: Nonpolarized Capacitor (Surface Mount)
  C50 C52 C59 C61 C63 C66 C69 C78 C80 C82 C84 C89 C91 C93 C95 C97 C99 C101 C103 C105 C107: Value: 22uF
  C51 C53 C55 C60 C62 C64 C65 C67 C70-C77 C79 C81 C83 C85 C87 C88 C90 C92 C94 C96 C98 C100 C102 C104 C106 C108: Value: 100nF
  C54: Value: 10uF
  C56: Value: 4.7nF
  C57: Value: 220nF
  C58: Value: 10pF
  C68: Value: 10nF
D1 = D Schottky: Schottky Diode
FIBER = Header 4X2: Header, 4-Pin, Dual row; LatestRevisionDate: 17-Jul-2002; LatestRevisionNote: Re-released for DXP Platform.; Publisher: Altium Limited
L51 = Inductor_1: Inductor
MAGA SUNSEN = Header 2X2: Header, 2-Pin, Dual row; LatestRevisionDate: 17-Jul-2002; LatestRevisionNote: Re-released for DXP Platform.; Publisher: Altium Limited
MAGB = Header 3X2: Header, 3-Pin, Dual row; LatestRevisionDate: 17-Jul-2002; LatestRevisionNote: Re-released for DXP Platform.; Publisher: Altium Limited
R50-R77 R80-R101 = Res_1: Resistor
  R50 R54 R56 R74 R76 R92 R94 R96 R98 R100: Value: 100K
  R51 R57 R75 R95 R97 R99 R101: Value: 73.2K
  R52 R63-R66: Value: 10
  R53 R69: Value: 412K
  R55: Value: 150K
  R58-R60 R68 R70-R73 R80-R91: Value: 10K
  R67: Value: 931K
  R77 R93: Value: 210K
T1 T2 = TVS-0502B: ESD Protection Array
U05 = SN65HVD76: 3.3-V 422/485 Transceivers
U06 = MAX3227E: RS-232 Transceiver
U07 U08 = TCA9517: I2C A-side drivers and B-side drivers
UC01 UC04 UC05 UC06 = TPS2553DBV: PRECISION ADJUSTABLE CURRENT-LIMITED POWER-DISTRIBUTION SWITCHES
UC02 UC07 UC08 UC09 UC10 = TPS2556DRB: PRECISION ADJUSTABLE CURRENT-LIMITED POWER-DISTRIBUTION SWITCHES
UC03 = TPS25940x: 18V eFuse with True Reverse Blocking and DevSleep Support for SSDs
UP01 = TPS63700: DC-DC Inverter

## Nets that join several sheets
GND: OBC_My_FPGA (71 pins), OBC_My_INTERFACE (116 pins)
VOUT_3V3: OBC_My_FPGA (C27.1 P2.27 P2.28 U5.3), OBC_My_INTERFACE (46 pins)
VOUT_5V: OBC_My_FPGA (P2.25 P2.26), OBC_My_INTERFACE (28 pins)
VOUT_BATT: OBC_My_FPGA (12 pins), OBC_My_INTERFACE (7 pins)
/FLT_Ant1_5V: OBC_My_FPGA (F1.128), OBC_My_INTERFACE (R98.2 UC09.8)
/FLT_Ant2_5V: OBC_My_FPGA (F1.125), OBC_My_INTERFACE (R100.2 UC10.8)
/FLT_FIBGY+3.3: OBC_My_FPGA (F1.31), OBC_My_INTERFACE (R56.2 UC02.8)
/FLT_FIBGY-3.3: OBC_My_FPGA (F1.37), OBC_My_INTERFACE (R50.2 UC01.4)
/FLT_MAGA: OBC_My_FPGA (F1.10), OBC_My_INTERFACE (R68.2 UC03.20)
/FLT_MAGB_3.3: OBC_My_FPGA (F1.150), OBC_My_INTERFACE (R76.2 UC05.4)
/FLT_MAGB_5: OBC_My_FPGA (F1.148), OBC_My_INTERFACE (R74.2 UC04.4)
/FLT_Sb1_5V: OBC_My_FPGA (F1.143), OBC_My_INTERFACE (R94.2 UC07.8)
/FLT_Sb2_5V: OBC_My_FPGA (F1.145), OBC_My_INTERFACE (R96.2 UC08.8)
/FLT_SUNSEN_3.3: OBC_My_FPGA (F1.119), OBC_My_INTERFACE (R92.2 UC06.4)
Ant1: OBC_My_FPGA (F1.134), OBC_My_INTERFACE (ANT1.1 R80.1)
Ant2: OBC_My_FPGA (F1.133), OBC_My_INTERFACE (A2.1 R81.1)
Ant3: OBC_My_FPGA (F1.132), OBC_My_INTERFACE (A3.1 R82.1)
Ant4: OBC_My_FPGA (F1.131), OBC_My_INTERFACE (A4.1 R83.1)
EN_Ant1_5V: OBC_My_FPGA (F1.127), OBC_My_INTERFACE (UC09.4)
EN_Ant2_5V: OBC_My_FPGA (F1.124), OBC_My_INTERFACE (UC10.4)
EN_FIBGY+3.3: OBC_My_FPGA (F1.30), OBC_My_INTERFACE (UC02.4)
EN_FIBGY-3.3: OBC_My_FPGA (F1.38), OBC_My_INTERFACE (UC01.3)
EN_MAGA: OBC_My_FPGA (F1.11), OBC_My_INTERFACE (UC03.14)
EN_MAGB_3.3: OBC_My_FPGA (F1.149), OBC_My_INTERFACE (UC05.3)
EN_MAGB_5: OBC_My_FPGA (F1.147), OBC_My_INTERFACE (UC04.3)
EN_Sb1_5V: OBC_My_FPGA (F1.144), OBC_My_INTERFACE (UC07.4)
EN_Sb2_5V: OBC_My_FPGA (F1.146), OBC_My_INTERFACE (UC08.4)
EN_SUNSEN_3.3: OBC_My_FPGA (F1.120), OBC_My_INTERFACE (UC06.3)
FIBERGYRO_RX: OBC_My_FPGA (F1.35), OBC_My_INTERFACE (R60.2 U05.2)
FIBERGYRO_RX_/RE: OBC_My_FPGA (F1.34), OBC_My_INTERFACE (R58.2 U05.3)
FIBERGYRO_TX: OBC_My_FPGA (F1.32), OBC_My_INTERFACE (U05.5)
FIBERGYRO_TX_DE: OBC_My_FPGA (F1.33), OBC_My_INTERFACE (R59.1 U05.4)
MAGA_PC_/INVALID: OBC_My_FPGA (F1.8), OBC_My_INTERFACE (U06.10)
MAGA_PC_RD: OBC_My_FPGA (F1.9), OBC_My_INTERFACE (U06.9)
MAGA_PC_READY: OBC_My_FPGA (F1.6), OBC_My_INTERFACE (U06.1)
MAGA_PC_TD: OBC_My_FPGA (F1.7), OBC_My_INTERFACE (U06.11)
MAGB_PC_EN: OBC_My_FPGA (F1.153), OBC_My_INTERFACE (U07.5)
MAGB_PC_SCL: OBC_My_FPGA (F1.152), OBC_My_INTERFACE (R71.2 U07.2)
MAGB_PC_SDA: OBC_My_FPGA (F1.151), OBC_My_INTERFACE (R70.2 U07.3)
Sab1: OBC_My_FPGA (F1.138), OBC_My_INTERFACE (R84.1 SAB1.1)
Sab2: OBC_My_FPGA (F1.137), OBC_My_INTERFACE (R85.1 S2.1)
Sab3: OBC_My_FPGA (F1.136), OBC_My_INTERFACE (R86.1 S3.1)
Sab4: OBC_My_FPGA (F1.135), OBC_My_INTERFACE (R87.1 S4.1)
SUNSEN_PC_EN: OBC_My_FPGA (F1.116), OBC_My_INTERFACE (U08.5)
SUNSEN_PC_SCL: OBC_My_FPGA (F1.118), OBC_My_INTERFACE (R89.2 U08.2)
SUNSEN_PC_SDA: OBC_My_FPGA (F1.117), OBC_My_INTERFACE (R88.2 U08.3)